# EAGLE design slider (EAGLE 7.6.0)
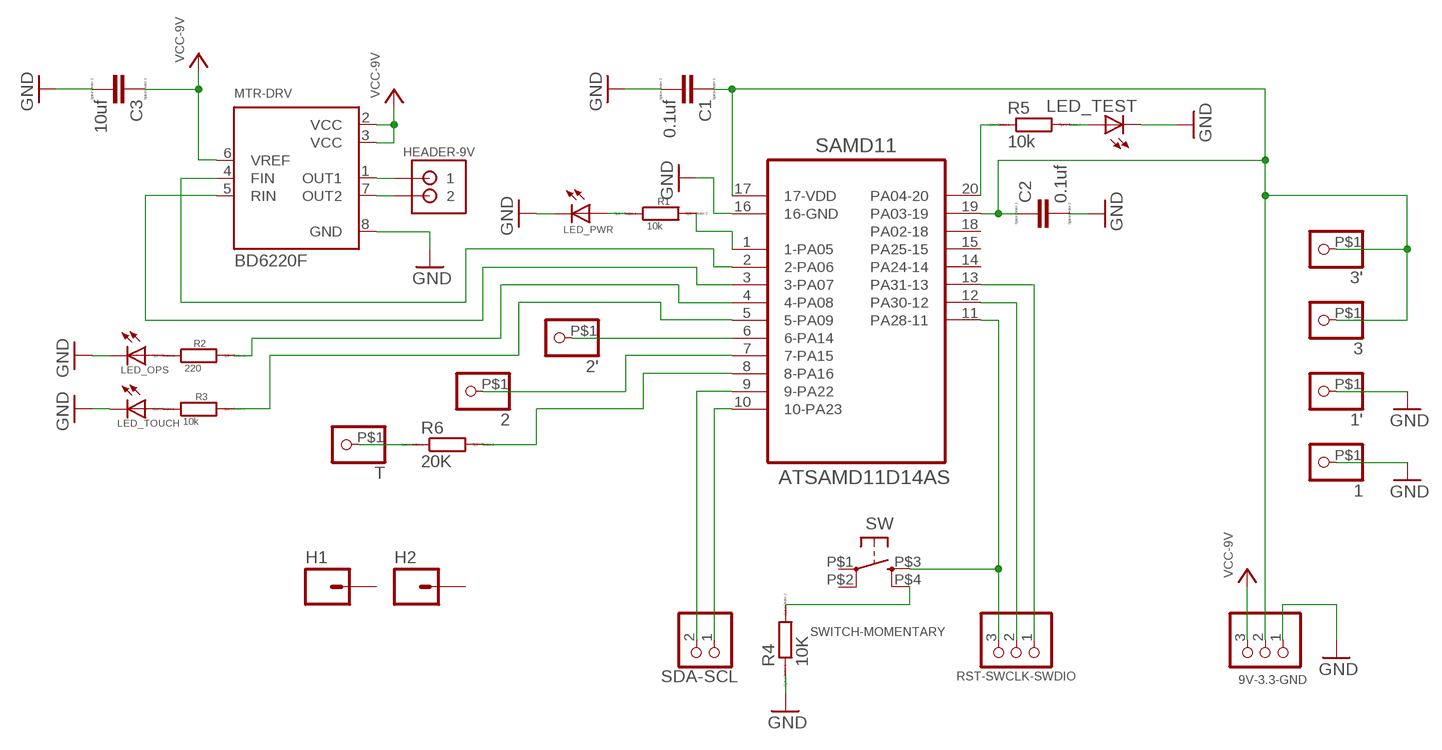
[diagram p0: schematic, sheet 1]

## Parts
1  PINHD-1X1  [1X01]
1'  PINHD-1X1  [1X01]
2  PINHD-1X1  [1X01]
2'  PINHD-1X1  [1X01]
3  PINHD-1X1  [1X01]
3'  PINHD-1X1  [1X01]
9V-3.3-GND  PINHD-1X3  [1X03]
C1  0.1uf  C  [C0805]
C2  0.1uf  C  [C0805]
C3  10uf  C  [C0805]
H1  M01PTH_2MM  [1X01_2MM]
H2  M01PTH_2MM  [1X01_2MM]
HEADER-9V  JST-PH_2-PIN_HEADER  [JST_B2B-PH_HEADER]
LED_OPS  LEDCHIP-LED0805  [CHIP-LED0805]
LED_PWR  LEDCHIP-LED0805  [CHIP-LED0805]
LED_TEST  LEDCHIP-LED0805  [CHIP-LED0805]
LED_TOUCH  LEDCHIP-LED0805  [CHIP-LED0805]
MTR-DRV  BD6220F  [SOP8]
R1  10k  R  [R0805]
R2  220  R  [R0805]
R3  10k  R  [R0805]
R4  10K  R  [R0805]
R5  10k  R  [R0805]
R6  20K  R  [R0805]
RST-SWCLK-SWDIO  PINHD-1X3  [1X03]
SAMD11  ATSAMD11D14AS  [SOIC20]
SDA-SCL  PINHD-1X2  [1X02]
SW  SWITCH-MOMENTARY  [SWITCH-MOMENTARY]
T  PINHD-1X1  [1X01]

## Nets
GND: 1'.P$1 1.P$1 9V-3.3-GND.1 C1.2 C2.2 C3.2 LED_OPS.C LED_PWR.C LED_TEST.C LED_TOUCH.C MTR-DRV.8(GND) R4.1 SAMD11.16(16-GND)
N$1: R5.1 SAMD11.20(PA04-20)
N$2: 3'.P$1 3.P$1 9V-3.3-GND.2 C1.1 C2.1 SAMD11.17(17-VDD) SAMD11.19(PA03-19)
N$3: HEADER-9V.P1 MTR-DRV.1(OUT1)
N$4: HEADER-9V.P2 MTR-DRV.7(OUT2)
N$5: LED_PWR.A R1.1
N$6: R1.2 SAMD11.1(1-PA05)
N$7: MTR-DRV.4(FIN) SAMD11.2(2-PA06)
N$8: MTR-DRV.5(RIN) SAMD11.3(3-PA07)
N$9: LED_OPS.A R2.1
N$10: R2.2 SAMD11.4(4-PA08)
N$11: R3.2 SAMD11.5(5-PA09)
N$12: LED_TOUCH.A R3.1
N$13: R6.1 T.P$1
N$14: 2'.P$1 SAMD11.6(6-PA14)
N$15: 2.P$1 SAMD11.7(7-PA15)
N$16: SAMD11.9(9-PA22) SDA-SCL.2
N$17: R6.2 SAMD11.8(8-PA16)
N$18: SAMD11.10(10-PA23) SDA-SCL.1
N$19: RST-SWCLK-SWDIO.3 SAMD11.11(PA28-11) SW.P$3
N$20: RST-SWCLK-SWDIO.2 SAMD11.12(PA30-12)
N$21: RST-SWCLK-SWDIO.1 SAMD11.13(PA31-13)
N$22: R4.2 SW.P$4
N$23: LED_TEST.A R5.2
VCC: 9V-3.3-GND.3 C3.1 MTR-DRV.2(VCC) MTR-DRV.3(VCC) MTR-DRV.6(VREF) ; supply symbol labelled VCC-9V
Unconnected: H1.1 H2.1 SAMD11.14(PA24-14) SAMD11.15(PA25-15) SAMD11.18(PA02-18) SW.P$1 SW.P$2

## Library data of the parts
1 1' 2 2' 3 3' T = Filo:PINHD-1X1: PIN HEADER
9V-3.3-GND RST-SWCLK-SWDIO = pinhead:PINHD-1X3: PIN HEADER
C1-C3 = eagle-ltspice:C: CAPACITOR, European symbol; SPICEMODEL: NONE; SPICEPREFIX: C
H1 H2 = SparkFun-Connectors:M01: Header 1 Standard 1-pin 0.1" header. Use with straight break away headers (SKU : PRT-00116), right angle break away headers (PRT-00553), swiss pins (PRT-00743), machine pins (PRT-00117), and female headers (PRT-00115). SMTSO-256-ET is a "flush mount" nut for a 4-40 screw. The older package used to be too tight, and did not allow it to sit properly thru the drill hit. The latest (0.165DIA) fits nice and snug.
HEADER-9V = SRG:JST-PH_2-PIN_HEADER: 2-pin JST PH Shrouded Header, top entry P/N B2B-PH-K-S Mating connector PHR-2 Mating cable assembly: Sparkfun PRT-09914 <http://www.sparkfun.com/products/9914>
LED_OPS LED_PWR LED_TEST LED_TOUCH = led:LED: LED OSRAM: - CHIPLED LG R971, LG N971, LY N971, LG Q971, LY Q971, LO R971, LY R971 LH N974, LH R974 LS Q976, LO Q976, LY Q976 LO Q996 - Hyper CHIPLED LW Q18S LB Q993, LB Q99A, LB R99A - SideLED LS A670, LO A670, LY A670, LG A670, LP A670 LB A673, LV A673, LT A673, LW A673 LH A674 LY A675 LS A676, LA A676, LO A676, LY A676, LW A676 LS A679, LY A679, LG A679 - Hyper Micro SIDELED® LS Y876, LA Y876, LO Y876, LY Y876 LT Y87S - SmartLED LW L88C, LW L88S LB L89C, LB L89S, LG L890 LS L89K, LO L89K, LY L89K LS L896, LA L896, LO L896, LY L896 - TOPLED LS T670, LO T670, LY T670, LG T670, LP T670 LSG T670, LSP T670, LSY T670, LOP T670, LYG T670 LG T671, LOG T671, LSG T671 LB T673, LV T673, LT T673, LW T673 LH T674 LS T676, LA T676, LO T676, LY T676, LB T676, LH T676, LSB T676, LW T676 LB T67C, LV T67C, LT T67C, LS T67K, LO T67K, LY T67K, LW E67C LS E67B, LA E67B, LO E67B, LY E67B, LB E67C, LV E67C, LT E67C LW T67C LS T679, LY T679, LG T679 LS T770, LO T770, LY T770, LG T770, LP T770 LB T773, LV T773, LT T773, LW T773 LH T774 LS E675, LA E675, LY E675, LS T675 LS T776, LA T776, LO T776, LY T776, LB T776 LHGB T686 LT T68C, LB T68C - Hyper Mini TOPLED® LB M676 - Mini TOPLED Santana® LG M470 LS M47K, LO M47K, LY M47K Source: http://www.osram.convergy.de LUXEON: - LUMILED® LXK2-PW12-R00, LXK2-PW12-S00, LXK2-PW14-U00, LXK2-PW14-V00 LXK2-PM12-R00, LXK2-PM12-S00, LXK2-PM14-U00 LXK2-PE12-Q00, LXK2-PE12-R00, LXK2-PE12-S00, LXK2-PE14-T00, LXK2-PE14-U00 LXK2-PB12-K00, LXK2-PB12-L00, LXK2-PB12-M00, LXK2-PB14-N00, LXK2-PB14-P00, LXK2-PB14-Q00 LXK2-PR12-L00, LXK2-PR12-M00, LXK2-PR14-Q00, LXK2-PR14-R00 LXK2-PD12-Q00, LXK2-PD12-R00, LXK2-PD12-S00 LXK2-PH12-R00, LXK2-PH12-S00 LXK2-PL12-P00, LXK2-PL12-Q00, LXK2-PL12-R00 Source: www.luxeon.com KINGBRIGHT: KA-3528ASYC Source: www.kingbright.com
MTR-DRV = rohm:BD6220: H-bridge drivers (18V max.) Source: http://www.farnell.com/datasheets/389117.pdf
R1-R6 = eagle-ltspice:R: RESISTOR, European symbol; SPICEMODEL: NONE; SPICEPREFIX: R
SAMD11 = Atmel_By_element14_Batch_1-00:ATSAMD11D14AS: ATMEL SAMD11D14AS SOIC20
SDA-SCL = pinhead:PINHD-1X2: PIN HEADER
SW = Filo:SWITCH-MOMENTARY

## Board
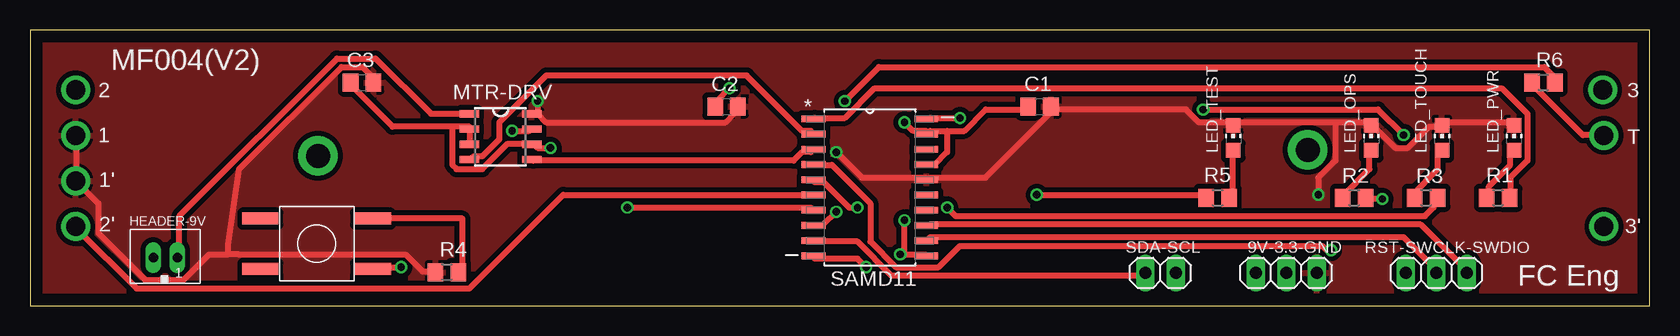
[diagram p1: board, top side]
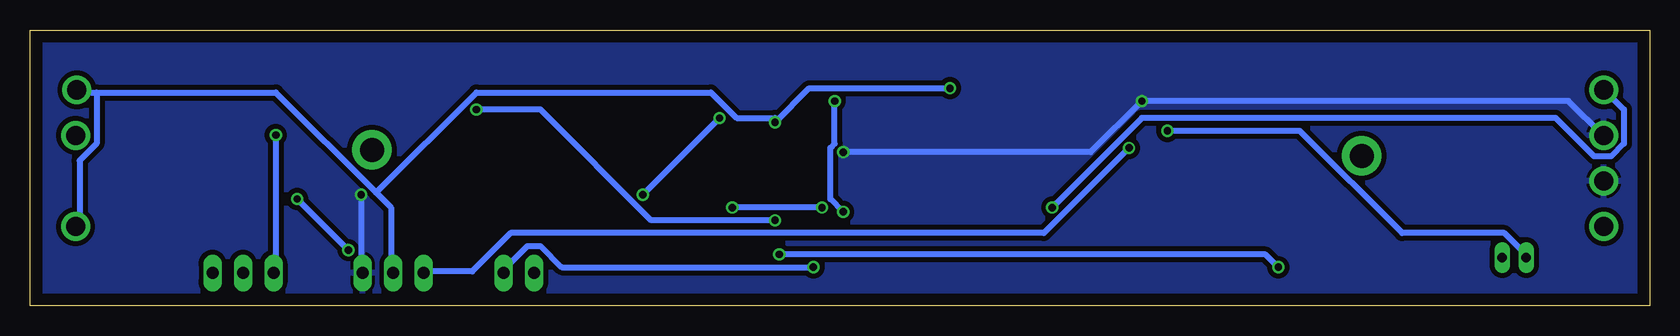
[diagram p2: board, bottom side, seen from below]

Size 135 x 23 mm. Coordinates in mm from the lower left corner, seen from the top.
Outline: 0,0 135,0 135,23 0,23 0,0
Copper layers (1*16): Top 0.035mm / dielectric 1.5mm / Bottom 0.035mm
Design rules "default *": minimum track width 20mil, minimum drill 24mil, track to track 8mil, track to pad 8mil, pad to pad 8mil, via to via 8mil, smd to smd 8mil, copper to edge 40mil, drill to drill 8mil, minimum pad ring 10mil, minimum via ring 8mil, stop-mask expansion 4mil, vias tented up to drill 0mil, thermal gap 10mil

### Footprints (pad centres in the part's own frame; a part is rotated, then mirrored left to right if it is on the bottom)
1X01 = drill 1.6: P$1 0,0
1X03 = drill 1.016 long: 1 -2.54,0; 2 0,0; 3 2.54,0
C0805 = smd 1.3 x 1.5: 1 -0.95,0; 2 0.95,0
1X01_2MM = drill 2 pad 3.302: 1 0,0
JST_B2B-PH_HEADER = drill 0.8 long: P1 1.075,0.048; P2 -0.925,0.048
CHIP-LED0805 = smd 1.2 x 1.2: A 0,-1.05; C 0,1.05
SOP8 = smd 0.6 x 1.6: 1 -1.905,-2.6; 2 -0.635,-2.6; 3 0.635,-2.6; 4 1.905,-2.6; 5 1.905,2.6; 6 0.635,2.6; 7 -0.635,2.6; 8 -1.905,2.6
R0805 = smd 1.3 x 1.5: 1 -0.95,0; 2 0.95,0
SOIC20 = smd 1.981 x 0.559: 1 -4.699,5.715; 2 -4.699,4.445; 3 -4.699,3.175; 4 -4.699,1.905; 5 -4.699,0.635; 6 -4.699,-0.635; 7 -4.699,-1.905; 8 -4.699,-3.175; 9 -4.699,-4.445; 10 -4.699,-5.715; 11 4.699,-5.715; 12 4.699,-4.445; 13 4.699,-3.175; 14 4.699,-1.905; 15 4.699,-0.635; 16 4.699,0.635; 17 4.699,1.905; 18 4.699,3.175; 19 4.699,4.445; 20 4.699,5.715
1X02 = drill 1.016 long: 1 -1.27,0; 2 1.27,0
SWITCH-MOMENTARY = smd 3 x 1: P$1 -4.7,2.1; P$2 -4.7,-2.1; P$3 4.7,-2.1; P$4 4.7,2.1

### Placement (x,y rotation side)
1  3.8,14.2 0 top
1'  3.8,10.4 0 top
2  3.8,18 0 top
2'  3.8,6.6 0 top
3  131.1,18 0 top
3'  131.2,6.6 0 top
9V-3.3-GND  104.72,2.72 180 top
C1  84.15,16.61 0 top
C2  58.06,16.61 0 top
C3  27.68,18.61 0 top
H1  24,12.5 0 top
H2  106.5,13 0 top
HEADER-9V  11.21,3.96 0 top
LED_OPS  111.8,14 0 top
LED_PWR  123.7,14 0 top
LED_TEST  100.3,14 0 top
LED_TOUCH  117.7,14 0 top
MTR-DRV  39.23,14.1 270 top
R1  122.38,9 0 top
R2  110.38,9 0 top
R3  116.38,9 0 top
R4  34.75,2.79 0 top
R5  99,9 0 top
R6  126.15,18.62 0 top
RST-SWCLK-SWDIO  117.24,2.72 180 top
SAMD11  70.01,9.86 0 top
SDA-SCL  94.24,2.72 180 top
SW  23.9,5.16 0 top
T  131.2,14.2 0 top

### Tracks (layer width: path | path; a pad name or v marks a point on that pad's centre or on a via)
GND  (via drill 0.61)
  Top 0.508: LED_PWR.C 123.39,15.29 117.7,15.29 LED_TOUCH.C 117.35,14.94 116.64,14.94 114.86,13.16 113.79,13.16 112.01,14.94 LED_OPS.C 111.66,15.29 108.81,15.29 | 108.81,15.29 100.64,15.29 LED_TEST.C 100.28,15.29 97.43,15.29 96.37,16.36 85.34,16.36 C1.2 84.99,16.36 84.99,16 79.65,10.67 75.03,10.67 SAMD11.16 74.68,10.67 69.34,10.67 v67.21,12.8 | v107.39,9.25 107.39,10.67 108.81,12.09 108.81,15.29 | 42.32,16 43.03,15.29 57.96,15.29 58.67,16 58.67,16.36 C2.2 | 42.32,16 41.96,16 MTR-DRV.8 42.32,16 | 16.51,4.27 14.94,4.27 12.8,2.13 9.6,2.13 5.69,6.04 5.69,8.53 3.91,10.31 1'.P$1 3.91,10.67 3.91,13.87 1.P$1 | R4.1 33.78,2.85 32.72,2.85 31.29,4.27 17.42,4.27 16.51,4.27 | 16.51,4.27 16.51,5.08 17.42,11.38 25.96,19.91 27.74,19.91 28.45,19.2 28.45,18.85 C3.2 | v42.32,17.07 42.32,16
  Bottom 0.508: v107.39,9.25 107.39,2.85 9V-3.3-GND.1 | 1.P$1 3.91,14.22 6.76,17.07 v42.32,17.07 46.58,12.8 v67.21,12.8
  pour Bottom (isolate 0.406): 0,0 0,22.86 134.62,22.86 134.62,0
  pour Top (isolate 0.406): 0,0 0,22.86 134.62,22.86 134.62,0
N$1  (via drill 0.61)
  Top 0.508: v83.92,9.25 97.79,9.25 R5.1 | v77.52,15.65 75.03,15.65 SAMD11.20
  Bottom 0.508: v77.52,15.65 v83.92,9.25
N$2  (via drill 0.61)
  Top 0.508: v58.32,18.14 57.25,17.07 57.25,16.71 C2.1 | v72.9,15.29 73.61,14.58 74.68,14.58 SAMD11.19 75.03,14.58 76.45,14.58 | 76.45,14.58 77.88,14.58 79.65,16.36 82.86,16.36 C1.1 | 76.45,14.58 76.45,12.8 75.39,11.73 75.03,11.73 SAMD11.17
  Bottom 0.508: v58.32,18.14 70.05,18.14 v72.9,15.29 72.9,15.65 76.1,15.65 78.23,17.78 97.79,17.78 106.15,9.42 | 106.15,9.42 114.5,17.78 129.44,17.78 | 106.15,9.42 104.9,8.18 104.9,2.85 9V-3.3-GND.2 | 129.44,17.78 130.86,17.78 3.P$1 | 129.44,17.78 129.44,13.51 130.86,12.09 130.86,6.76 3'.P$1
N$3
  Top 0.508: MTR-DRV.1 33.43,16 28.8,20.62 25.6,20.62 12.45,7.47 12.45,4.27 HEADER-9V.P1
N$4  (via drill 0.61)
  Top 0.508: v40.18,14.58 41.6,14.58 MTR-DRV.7
  Bottom 0.508: v40.18,14.58 29.16,14.58 20.62,6.04 12.09,6.04 10.31,4.27 HEADER-9V.P2
N$5
  Top 0.508: LED_PWR.A 123.39,12.8 123.39,11.73 121.61,9.96 121.61,9.25 R1.1
N$6
  Top 0.508: R1.2 123.39,9.25 123.39,10.67 124.82,12.09 124.82,16 122.68,18.14 70.41,18.14 67.92,15.65 65.43,15.65 SAMD11.1
N$7
  Top 0.508: MTR-DRV.4 36.98,12.45 37.69,12.45 39.12,13.87 39.12,15.29 43.03,19.2 59.74,19.2 64.36,14.58 65.08,14.58 SAMD11.2
N$8
  Top 0.508: MTR-DRV.5 41.96,12.09 63.65,12.09 64.36,12.8 65.08,12.8 SAMD11.3
N$9
  Top 0.508: LED_OPS.A 111.66,12.8 111.66,11.38 109.53,9.25 R2.1
N$10  (via drill 0.61)
  Top 0.508: v112.72,8.89 111.66,8.89 R2.2 | v108.46,4.62 108.1,4.62 107.75,4.98 77.52,4.98 75.74,3.2 72.19,3.2 70.05,5.33 70.05,8.53 66.85,11.73 65.43,11.73 SAMD11.4
  Bottom 0.508: v108.46,4.62 v112.72,8.89
N$11  (via drill 0.61)
  Top 0.508: v76.45,8.18 77.17,7.47 116.28,7.47 116.99,8.18 116.99,8.89 R3.2 | v68.99,8.18 68.28,8.18 66.14,10.31 65.43,10.31 SAMD11.5
  Bottom 0.508: v68.99,8.18 v76.45,8.18
N$12
  Top 0.508: LED_TOUCH.A 117.35,12.8 117.35,11.38 115.21,9.25 R3.1
N$13
  Top 0.508: R6.1 125.53,18.49 125.53,18.14 129.44,14.22 130.86,14.22 T.P$1
N$14
  Top 0.508: SAMD11.6 65.08,9.25 44.45,9.25 36.63,1.42 8.89,1.42 3.91,6.4 2'.P$1
N$15  (via drill 0.61)
  Top 0.508: v49.78,8.18 65.08,8.18 SAMD11.7
  Bottom 0.508: v49.78,8.18 42.32,15.65 7.82,15.65 4.62,12.45 3.2,12.45 2.13,13.51 2.13,16.36 3.56,17.78 2.P$1
N$16
  Top 0.508: SAMD11.9 65.43,5.33 68.99,5.33 71.83,2.49 92.81,2.49 SDA-SCL.2
N$17  (via drill 0.61)
  Top 0.508: v67.92,17.07 70.76,19.91 126.24,19.91 126.95,19.2 126.95,18.85 R6.2 | v67.21,7.82 66.14,6.76 65.43,6.76 SAMD11.8
  Bottom 0.508: v67.92,17.07 67.92,13.51 68.28,13.16 68.28,8.89 v67.21,7.82
N$18  (via drill 0.61)
  Top 0.508: v69.7,3.2 68.99,3.91 65.43,3.91 SAMD11.10
  Bottom 0.508: v69.7,3.2 90.68,3.2 92.46,4.98 93.52,4.98 95.66,2.85 SDA-SCL.1
N$19  (via drill 0.61)
  Top 0.508: 72.9,4.27 74.68,4.27 SAMD11.11 | v30.94,3.2 28.8,3.2 28.45,2.85 SW.P$3 | v114.5,14.22 112.37,16.36 v97.79,16.36 | 72.9,4.27 v72.9,7.11 | 72.9,4.27 v72.54,4.27
  Bottom 0.508: v72.54,4.27 32,4.27 v30.94,3.2 | v114.5,14.22 114.5,2.85 RST-SWCLK-SWDIO.3 | v97.79,16.36 92.46,16.36 83.21,7.11 v72.9,7.11
N$20
  Top 0.508: SAMD11.12 75.03,5.69 114.5,5.69 117.35,2.85 RST-SWCLK-SWDIO.2
N$21
  Top 0.508: SAMD11.13 75.03,6.76 115.93,6.76 119.84,2.85 RST-SWCLK-SWDIO.1
N$22
  Top 0.508: R4.2 36.06,3.15 36.06,7.27 36.05,7.26 SW.P$4
N$23
  Top 0.508: LED_TEST.A 100.28,12.8 100.28,9.25 R5.2
VCC  (via drill 0.61)
  Top 0.508: 35.2,14.94 36.63,14.94 MTR-DRV.2 36.63,14.58 36.63,13.51 MTR-DRV.3 | 35.2,14.94 30.23,14.94 27.03,18.14 27.03,18.49 C3.1 | 35.2,14.94 35.2,11.73 35.56,11.38 37.69,11.38 39.83,13.51 41.6,13.51 MTR-DRV.6 41.96,13.51 42.32,13.16 v43.38,13.16
  Bottom 0.508: v43.38,13.16 50.49,6.04 94.94,6.04 98.15,2.85 102.06,2.85 9V-3.3-GND.3

### Text on the board
tNames: MF004(V2) | FC Eng